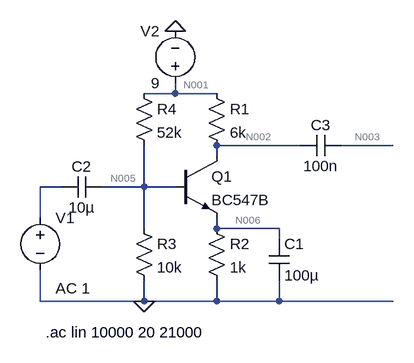
[diagram p0: schematic AMP_Simulation.asc]
AMP_Simulation.asc, the LTspice schematic file:
Version 4
SHEET 1 880 680
WIRE 160 16 160 0
WIRE 160 16 112 16
WIRE 224 16 160 16
WIRE 352 96 224 96
WIRE 496 96 416 96
WIRE 224 112 224 96
WIRE -16 160 -48 160
WIRE 112 160 112 96
WIRE 112 160 48 160
WIRE 160 160 112 160
WIRE -48 208 -48 160
WIRE 112 224 112 160
WIRE 224 224 224 208
WIRE 320 224 224 224
WIRE 320 240 320 224
WIRE -48 336 -48 288
WIRE 112 336 112 304
WIRE 112 336 -48 336
WIRE 224 336 224 304
WIRE 224 336 112 336
WIRE 320 336 320 304
WIRE 320 336 224 336
WIRE 496 336 320 336
FLAG 160 -80 0
FLAG 112 336 0
SYMBOL npn 160 112 R0
SYMATTR InstName Q1
SYMATTR Value BC547B
SYMBOL res 208 0 R0
SYMATTR InstName R1
SYMATTR Value 6k
SYMBOL res 208 208 R0
SYMATTR InstName R2
SYMATTR Value 1k
SYMBOL res 96 208 R0
SYMATTR InstName R3
SYMATTR Value 10k
SYMBOL res 96 0 R0
SYMATTR InstName R4
SYMATTR Value 52k
SYMBOL cap 304 240 R0
SYMATTR InstName C1
SYMATTR Value 100µ
SYMBOL cap 48 144 R90
WINDOW 0 0 32 VBottom 2
WINDOW 3 32 32 VTop 2
SYMATTR InstName C2
SYMATTR Value 10µ
SYMBOL cap 416 80 R90
WINDOW 0 0 32 VBottom 2
WINDOW 3 32 32 VTop 2
SYMATTR InstName C3
SYMATTR Value 100n
SYMBOL voltage -48 192 R0
WINDOW 123 24 124 Left 2
WINDOW 39 0 0 Left 0
SYMATTR Value2 AC 1
SYMATTR InstName V1
SYMATTR Value ""
SYMBOL voltage 160 16 R180
WINDOW 0 24 96 Left 2
WINDOW 3 24 16 Left 2
WINDOW 123 0 0 Left 0
WINDOW 39 0 0 Left 0
SYMATTR InstName V2
SYMATTR Value 9
TEXT -40 384 Left 2 !.ac lin 10000 20 21000

The netlist it stands for:
* AMP_Simulation.asc
Q1 N002 N005 N006 0 BC547B
R1 N001 N002 6k
R2 N006 0 1k
R3 N005 0 10k
R4 N001 N005 52k
C1 N006 0 100µ
C2 N005 N004 10µ
C3 N003 N002 100n
V1 N004 0 AC 1
V2 N001 0 9
.model NPN NPN
.model PNP PNP
.lib standard.bjt
.ac lin 10000 20 21000
.backanno
.end

* Results of the author's LTspice run, read from the files saved beside the schematic
* Operating Point, zero values left out:
*   V(n002) = 4.232 V
*   V(n005) = 1.429 V
*   V(n006) = 797.4 mV
*   V(n001) = 9 V
*   V(n003) = 423.2 nV
*   Ic(Q1) = 794.7 µA
*   Ib(Q1) = 2.689 µA
*   Ie(Q1) = -797.4 µA
*   I(R4) = 145.6 µA
*   I(R3) = 142.9 µA
*   I(R2) = 797.4 µA
*   I(R1) = 794.7 µA
*   I(V2) = -940.3 µA
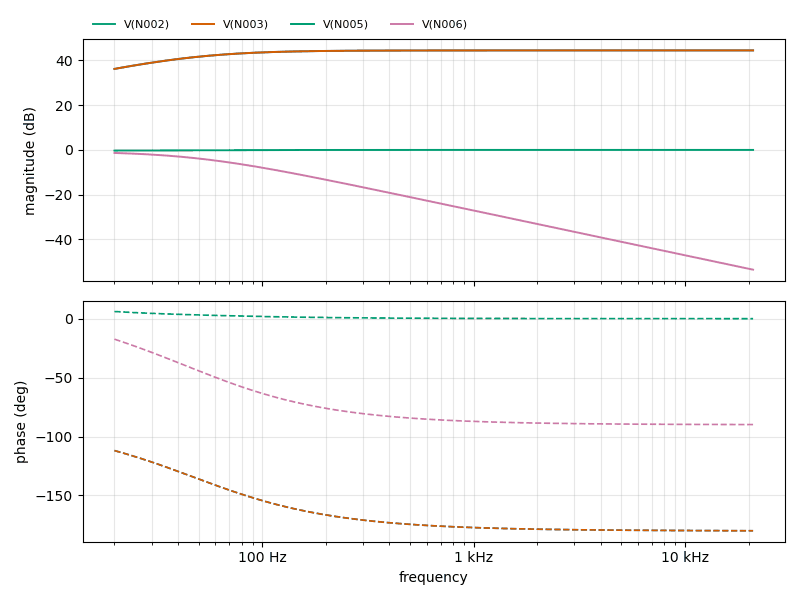
[diagram p1: AC Analysis of AMP_Simulation.asc, plotted from the saved traces]
* AC Analysis, 1 run:
*   V(N002): 36.19 dB at 20 Hz, 44.45 dB at 21 kHz, peak 44.45 dB at 21 kHz, 3 dB below the peak at 47.68 Hz
*   V(N003): 36.19 dB at 20 Hz, 44.45 dB at 21 kHz, peak 44.45 dB at 21 kHz, 3 dB below the peak at 47.68 Hz
*   V(N005): -0.29 dB at 20 Hz, -0.00 dB at 21 kHz, peak -0.00 dB at 21 kHz
*   V(N006): -1.35 dB at 20 Hz, -53.49 dB at 21 kHz, peak -1.35 dB at 20 Hz, 3 dB below the peak at 55.79 Hz